# Altium schematic sheet Flash.SchDoc
size A; SheetNumber: 12
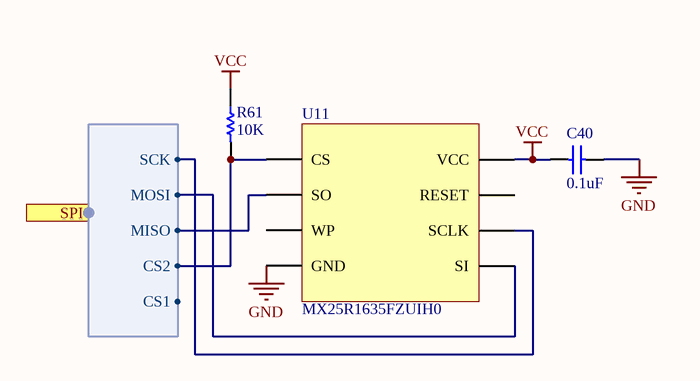
[diagram p0: Flash.SchDoc]

## Parts
C40  value 0.1uF  [C0603[1608X92]]  (hidden comment: 0.1uF 6.3V 0603)
R61  value 10K  [R0603[1608]]  (hidden comment: 10K 1% 0603)
U11  MX25R1635FZUIH0  [USON-8]

## Ports
SPI (harness SPI)

## Harnesses
SPI: SCK, MOSI, MISO, CS2, CS1

## Nets
GND: C40.2 U11.4(GND)
VCC: C40.1 R61.2 U11.8(VCC)
NetR61_1: R61.1 U11.1(CS) ; port SPI.CS2
NetU11_2: U11.2(SO) ; port SPI.MISO
NetU11_5: U11.5(SI) ; port SPI.MOSI
NetU11_6: U11.6(SCLK) ; port SPI.SCK

Not connected (* = marked no-connect by the designer): U11 3(WP) 7(RESET)

## Library data of the parts
C40 = CAP_0.1uF_6.3V_0603_10%: 0.1uF 6.3V 10% 0603 (1608 Metric); PartNumber: GRM188R70J104KA01D; Manufacturer: Murata; Mounting Technology: Surface Mount; PackageReference: 0603; PackageDescription: 0603 (1608 Metric); Voltage: 6.3V; Tolerance: 10%
R61 = RES_10K_0603_1%: 10K 0.25W 1% 0603 (1005 Metric); Manufacturer: Vishay; PartNumber: RCS060310K0FKEA; Tolerance: 1%; Power: 0.25W; Mounting Technology: Surface Mount; PackageReference: 0603; PackageDescription: 0603 (1608 Metric); ComponentLink1Description: Datasheet; ComponentLink1URL: http://www.vishay.com/docs/20065/rcse3.pdf
U11 = MX25R1635FZUIH0: pin to pad: 4>4+9; Manufacturer: Macronix; PartNumber: MX25R1635FZUIH0; Mounting Technology: Surface Mount; PackageReference: USON-8